# Altium schematic sheet sensors.SchDoc
size A; SheetNumber: 7; SheetTotal: 10
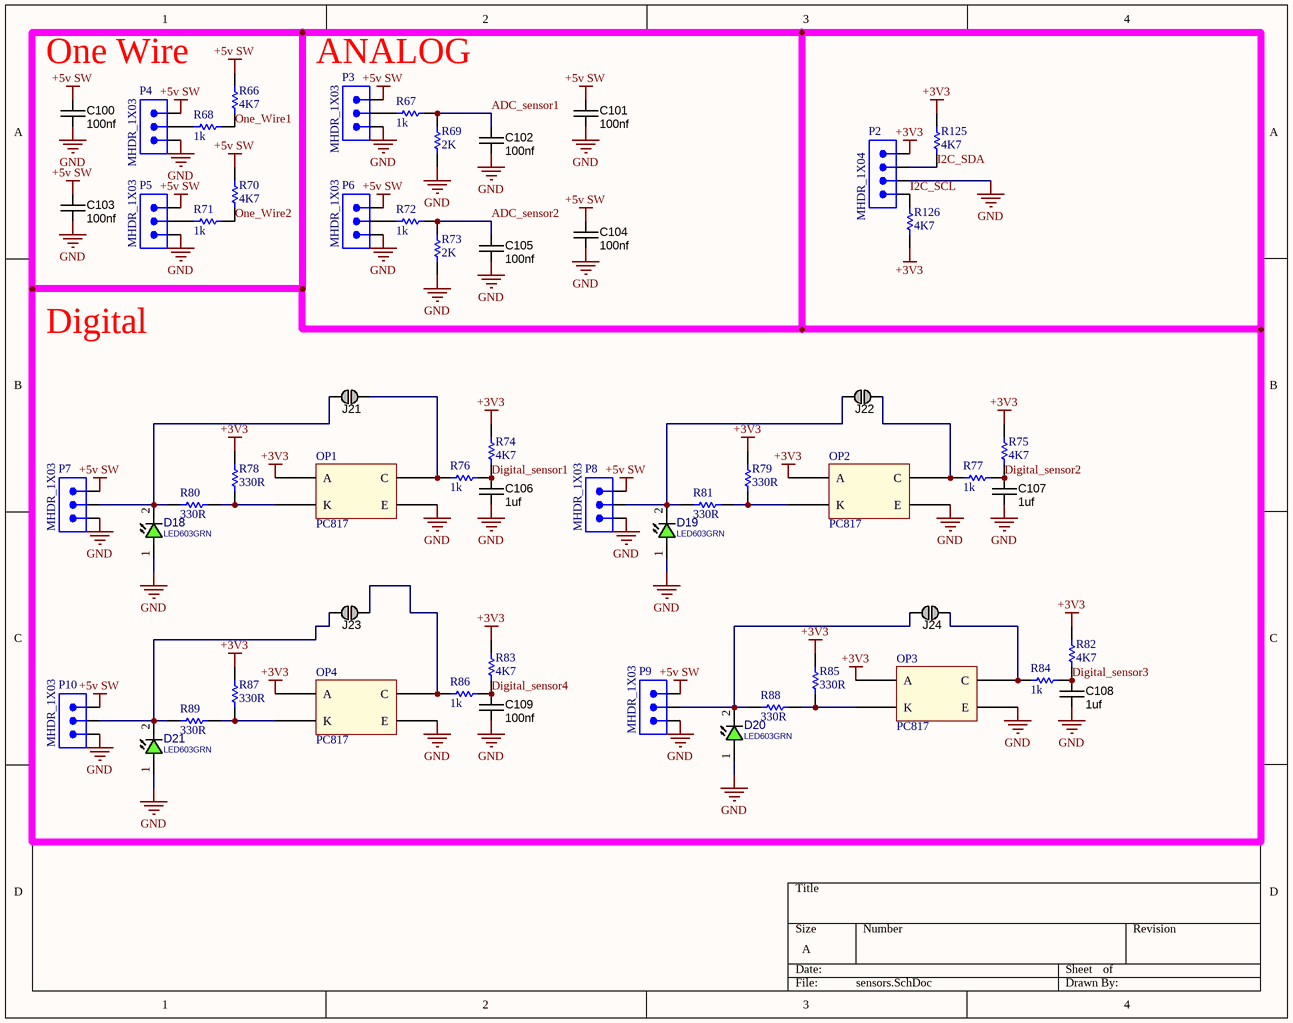
[diagram p0: sensors.SchDoc]

## Parts
C100  100nf  [CAPC1608X90N]
C101  100nf  [CAPC1608X90N]
C102  100nf  [CAPC1608X90N]
C103  100nf  [CAPC1608X90N]
C104  100nf  [CAPC1608X90N]
C105  100nf  [CAPC1608X90N]
C106  1uf  [CAPC1608X90N]
C107  1uf  [CAPC1608X90N]
C108  1uf  [CAPC1608X90N]
C109  100nf  [CAPC1608X90N]
D18  LED603GRN  [LED0603GRN]
D19  LED603GRN  [LED0603GRN]
D20  LED603GRN  [LED0603GRN]
D21  LED603GRN  [LED0603GRN]
J21  Jumper  [JUMP1]  (value not drawn)  (no BOM)
J22  Jumper  [JUMP1]  (value not drawn)  (no BOM)
J23  Jumper  [JUMP1]  (value not drawn)  (no BOM)
J24  Jumper  [JUMP1]  (value not drawn)  (no BOM)
OP1  PC817  [PC817 SMD]
OP2  PC817  [PC817 SMD]
OP3  PC817  [PC817 SMD]
OP4  PC817  [PC817 SMD]
P2  MHDR_1X04  [MHDR1X04-254P]
P3  MHDR_1X03  [MHDR1X03-254P]
P4  MHDR_1X03  [MHDR1X03-254P]
P5  MHDR_1X03  [MHDR1X03-254P]
P6  MHDR_1X03  [MHDR1X03-254P]
P7  MHDR_1X03  [MHDR1X03-254P]
P8  MHDR_1X03  [MHDR1X03-254P]
P9  MHDR_1X03  [MHDR1X03-254P]
P10  MHDR_1X03  [MHDR1X03-254P]
R66  4K7  [Resistor_SMD_0603 (1608)]
R67  1k  [Resistor_SMD_0603 (1608)]
R68  1k  [Resistor_SMD_0603 (1608)]
R69  2K  [Resistor_SMD_0603 (1608)]
R70  4K7  [Resistor_SMD_0603 (1608)]
R71  1k  [Resistor_SMD_0603 (1608)]
R72  1k  [Resistor_SMD_0603 (1608)]
R73  2K  [Resistor_SMD_0603 (1608)]
R74  4K7  [Resistor_SMD_0603 (1608)]
R75  4K7  [Resistor_SMD_0603 (1608)]
R76  1k  [Resistor_SMD_0603 (1608)]
R77  1k  [Resistor_SMD_0603 (1608)]
R78  330R  [Resistor_SMD_0603 (1608)]
R79  330R  [Resistor_SMD_0603 (1608)]
R80  330R  [Resistor_SMD_0603 (1608)]
R81  330R  [Resistor_SMD_0603 (1608)]
R82  4K7  [Resistor_SMD_0603 (1608)]
R83  4K7  [Resistor_SMD_0603 (1608)]
R84  1k  [Resistor_SMD_0603 (1608)]
R85  330R  [Resistor_SMD_0603 (1608)]
R86  1k  [Resistor_SMD_0603 (1608)]
R87  330R  [Resistor_SMD_0603 (1608)]
R88  330R  [Resistor_SMD_0603 (1608)]
R89  330R  [Resistor_SMD_0603 (1608)]
R125  4K7  [Resistor_SMD_0603 (1608)]
R126  4K7  [Resistor_SMD_0603 (1608)]

## Nets
+3V3: OP1.1(A) OP2.1(A) OP3.1(A) OP4.1(A) P2.4 R74.1 R75.1 R78.1 R79.1 R82.1 R83.1 R85.1 R87.1 R125.2 R126.2
+5v SW: C100.1 C101.1 C103.1 C104.1 P3.3 P4.3 P5.3 P6.3 P7.3 P8.3 P9.3 P10.3 R66.1 R70.1
GND: C100.2 C101.2 C102.2 C103.2 C104.2 C105.2 C106.2 C107.2 C108.2 C109.2 D18.1(ANODE) D19.1(ANODE) D20.1(ANODE) D21.1(ANODE) OP1.3(E) OP2.3(E) OP3.3(E) OP4.3(E) P2.2 P3.1 P4.1 P5.1 P6.1 P7.1 P8.1 P9.1 P10.1 R69.1 R73.1
ADC_sensor1: C102.1 R67.1 R69.2
ADC_sensor2: C105.1 R72.1 R73.2
Digital_sensor1: C106.1 R74.2 R76.1
Digital_sensor2: C107.1 R75.2 R77.1
Digital_sensor3: C108.1 R82.2 R84.1
Digital_sensor4: C109.1 R83.2 R86.1
I2C_SCL: P2.1 R126.1
I2C_SDA: P2.3 R125.1
One_Wire1: R66.2 R68.1
One_Wire2: R70.2 R71.1
NetD18_2: D18.2(CATHODE) J21.1 P7.2 R80.2
NetD19_2: D19.2(CATHODE) J22.1 P8.2 R81.2
NetD20_2: D20.2(CATHODE) J24.1 P9.2 R88.2
NetD21_2: D21.2(CATHODE) J23.1 P10.2 R89.2
NetJ21_2: J21.2 OP1.4(C) R76.2
NetJ22_2: J22.2 OP2.4(C) R77.2
NetJ23_2: J23.2 OP4.4(C) R86.2
NetJ24_2: J24.2 OP3.4(C) R84.2
NetOP1_2: OP1.2(K) R78.2 R80.1
NetOP2_2: OP2.2(K) R79.2 R81.1
NetOP3_2: OP3.2(K) R85.2 R88.1
NetOP4_2: OP4.2(K) R87.2 R89.1
NetP3_2: P3.2 R67.2
NetP4_2: P4.2 R68.2
NetP5_2: P5.2 R71.2
NetP6_2: P6.2 R72.2

## Notes on the sheet
- One Wire
- ANALOG
- Digital

## Library data of the parts
C100-C109 = CAPC_100n_0603_X7R_50V_10%: Capacitor SMD Cer 100nF 10% 50V X7R 0603; Manufacturer 1: AVX Corporation; Manufacturer Part Number 1: 06035C104KAT2A; Ratings: 50V; X7R; Material: ceramic; SCDType: spec; Value: 100n; Manufacturer 2: TDK Corporation; Manufacturer Part Number 2: C1608X7R1H104K; Package / Case: 0603 (1608 Metric); Tolerance: ±10%; Supplier 1: Digi-Key; Supplier Part Number 1: 478-5052-1-ND; ComponentLink1URL: http://www.avx.com/docs/Catalogs/cx7r.pdf; ComponentLink1Description: http://www.avx.com/docs/Catalogs/cx7r.pdf; Supplier 2: Digi-Key; Supplier Part Number 2: 445-1314-1-ND; ComponentLink2URL: http://product.tdk.com/capacitor/mlcc/en/documents/mlcc_commercial_general_en.pdf; ComponentLink2Description: http://product.tdk.com/capacitor/mlcc/en/documents/mlcc_commercial_general_en.pdf
D18-D21 = LED_SMD_0603_GRN: LED, SMD, 0603, GREEN; PARAM: 20mA; MANF: Kingbright; DESC: DESCRIPTION; MANF_P#: APT1608SGC; PARAM2: 2.2V; ASSEMBLY: ASSEMBLY; PRICE: 1: 0.14$, 100: 6.8$; VALUE: LED603GRN
J21-J24 = JUMP1: SMD jumper
OP1-OP4 = PC817: PC817 optocpler; ComponentLink2Description: Website Smart World; ComponentLink2URL: https://www.smartw.ir/; ComponentLink3Description: Telegram; ComponentLink3URL: https://t.me/altium_smartw; ComponentLink4Description: Instagram; ComponentLink4URL: https://Instagram.com/smartgw.ir; DatasheetVersion: 2021
P2 = MHDR_1X04: Male Header 1X04
P3-P10 = MHDR_1X03: Male Header 1X03
R66-R89 R125 R126 = Resistor: Resistor 0603; Email: razi.vesali@gmail.com; Value: 10k; Published: 17-Jun-2016; LatestRevisionNote: Re-released for puplic; Publisher: Seyed Razi Vesali